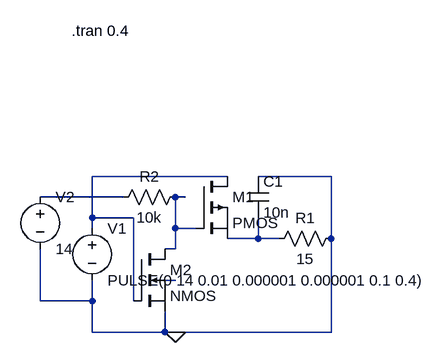
[diagram p0: schematic Draft43.asc]
Draft43.asc, the LTspice schematic file:
Version 4
SHEET 1 880 680
WIRE 480 304 272 304
WIRE 640 304 528 304
WIRE 320 336 192 336
WIRE 416 336 400 336
WIRE 272 368 272 304
WIRE 336 368 272 368
WIRE 272 384 272 368
WIRE 400 384 400 336
WIRE 432 384 400 384
WIRE 528 400 528 368
WIRE 528 400 480 400
WIRE 560 400 528 400
WIRE 640 400 640 304
WIRE 400 416 400 384
WIRE 400 416 384 416
WIRE 400 464 368 464
WIRE 192 496 192 416
WIRE 272 496 272 464
WIRE 272 496 192 496
WIRE 336 496 336 368
WIRE 272 544 272 496
WIRE 384 544 384 512
WIRE 384 544 272 544
WIRE 400 544 384 544
WIRE 640 544 640 400
WIRE 640 544 400 544
FLAG 400 544 0
SYMBOL voltage 272 368 R0
SYMATTR InstName V1
SYMATTR Value PULSE(0 14 0.01 0.000001 0.000001 0.1 0.4)
SYMBOL res 656 384 R90
WINDOW 0 0 56 VBottom 2
WINDOW 3 32 56 VTop 2
SYMATTR InstName R1
SYMATTR Value 15
SYMBOL res 304 352 R270
WINDOW 0 32 56 VTop 2
WINDOW 3 0 56 VBottom 2
SYMATTR InstName R2
SYMATTR Value 10k
SYMBOL cap 512 304 R0
SYMATTR InstName C1
SYMATTR Value 10n
SYMBOL pmos 432 304 R0
SYMATTR InstName M1
SYMBOL nmos 336 416 R0
SYMATTR InstName M2
SYMBOL voltage 192 320 R0
SYMATTR InstName V2
SYMATTR Value 14
TEXT 240 80 Left 2 !.tran 0.4

The netlist it stands for:
* Draft43.asc
V1 N001 0 PULSE(0 14 0.01 0.000001 0.000001 0.1 0.4)
R1 0 N004 15
R2 N002 N003 10k
C1 0 N004 10n
M1 N001 N003 N004 N004 PMOS
M2 N003 N001 0 0 NMOS
V2 N002 0 14
.model NMOS NMOS
.model PMOS PMOS
.lib standard.mos
.tran 0.4
.backanno
.end